# EAGLE design Helmet_Drop_V1 (EAGLE 9.6.2)
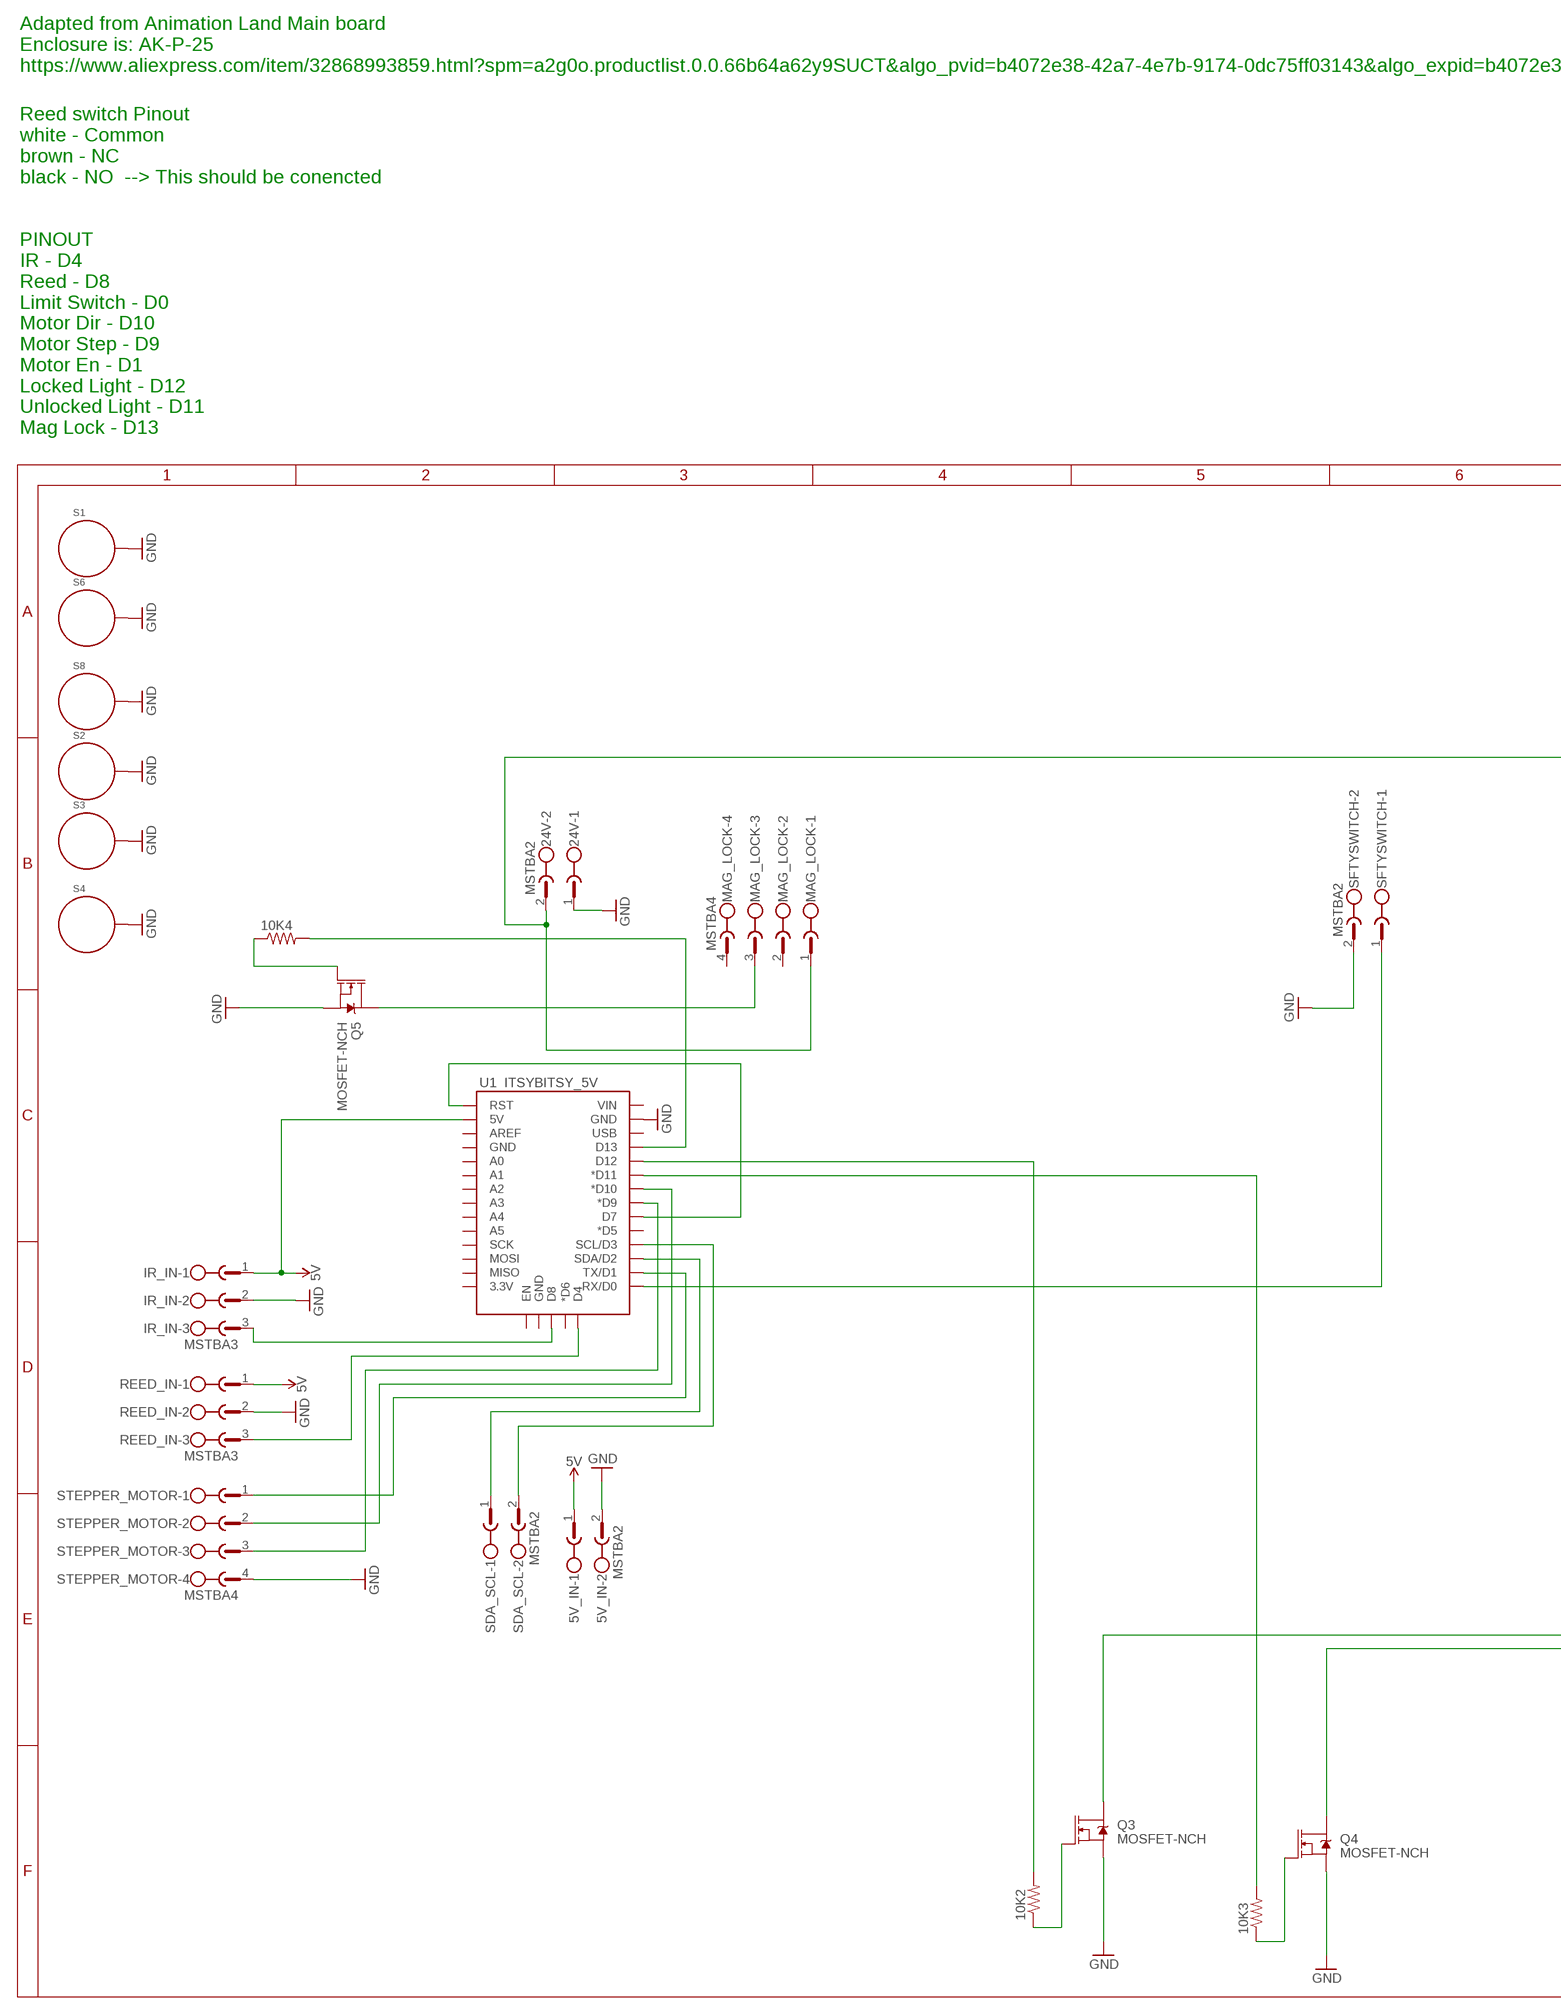
[diagram p0: schematic, sheet 1, part 1 of 2]
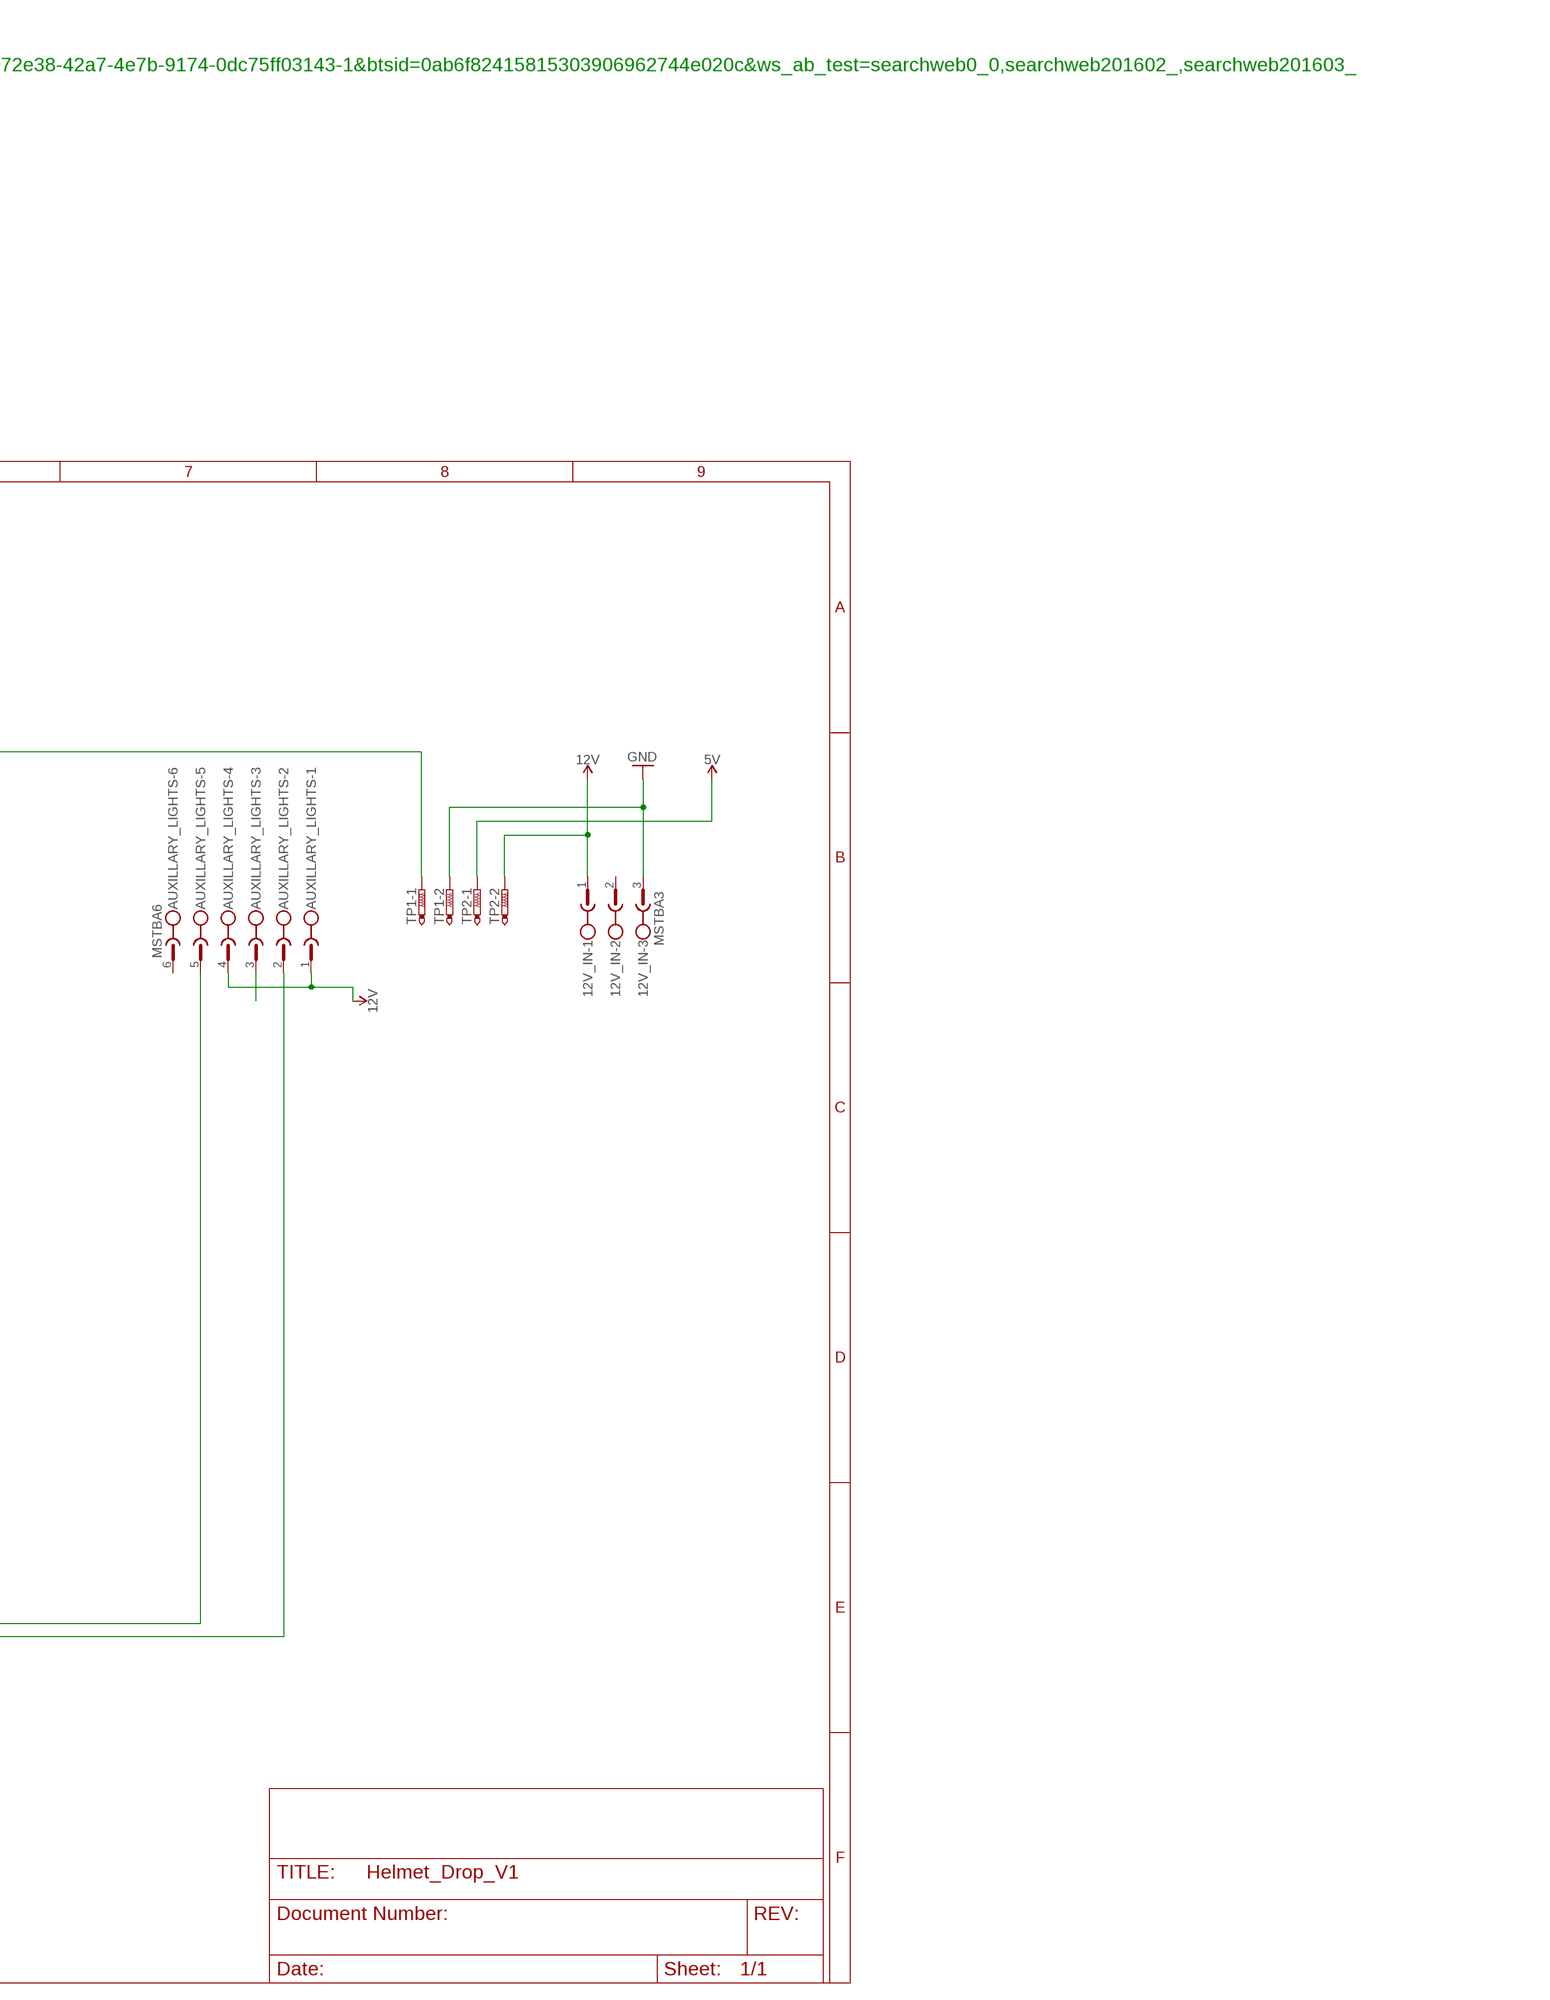
[diagram p1: schematic, sheet 1, part 2 of 2]

## Parts
5V_IN  MSTBA2  [MSTBA2]
10K2  R-US_M0805  [M0805]
10K3  R-US_M0805  [M0805]
10K4  R-US_M0805  [M0805]
12V_IN  MSTBA3  [MSTBA3]
24V  MSTBA2  [MSTBA2]
AUXILLARY_LIGHTS  MSTBA6  [MSTBA6]
IR_IN  MSTBA3  [MSTBA3]
MAG_LOCK  MSTBA4  [MSTBA4]
Q3  MOSFET-NCH  [SO-8_POWER_PAK]
Q4  MOSFET-NCH  [SO-8_POWER_PAK]
Q5  MOSFET-NCH  [SO-8_POWER_PAK]
REED_IN  MSTBA3  [MSTBA3]
S1  STANDOFF_ELECTRICAL5-32  [STANDOFF_ELECTRICAL_5_32]
S2  STANDOFF_ELECTRICAL5-32  [STANDOFF_ELECTRICAL_5_32]
S3  STANDOFF_ELECTRICAL5-32  [STANDOFF_ELECTRICAL_5_32]
S4  STANDOFF_ELECTRICAL5-32  [STANDOFF_ELECTRICAL_5_32]
S6  STANDOFF_ELECTRICAL5-32  [STANDOFF_ELECTRICAL_5_32]
S8  STANDOFF_ELECTRICAL5-32  [STANDOFF_ELECTRICAL_5_32]
SDA_SCL  MSTBA2  [MSTBA2]
SFTYSWITCH  MSTBA2  [MSTBA2]
STEPPER_MOTOR  MSTBA4  [MSTBA4]
TP1  PTR2  [P2-38-17]
TP2  PTR2  [P2-38-17]
U1  ITSYBITSY_5V  [ADAFRUIT_LENOARDO]

## Nets
5V: 5V_IN.1 IR_IN.1 REED_IN.1 TP2.TP-1 U1.5V
12V: 12V_IN.1 AUXILLARY_LIGHTS.1 AUXILLARY_LIGHTS.4 TP2.TP-2
GND: 5V_IN.2 12V_IN.3 24V.1 IR_IN.2 Q3.S Q4.S Q5.S REED_IN.2 S1.P1 S2.P1 S3.P1 S4.P1 S6.P1 S8.P1 SFTYSWITCH.2 STEPPER_MOTOR.4 TP1.TP-2 U1.GND@2(GND)
N$1: 10K4.2 U1.D13
N$2: SFTYSWITCH.1 U1.RX(RX/D0)
N$3: AUXILLARY_LIGHTS.3
N$4: STEPPER_MOTOR.3 U1.D9(*D9)
N$5: U1.D7 U1.RES(RST)
N$8: STEPPER_MOTOR.2 U1.D10(*D10)
N$10: AUXILLARY_LIGHTS.5 Q3.D1(D)
N$11: STEPPER_MOTOR.1 U1.TX(TX/D1)
N$12: 10K2.1 Q3.G
N$14: REED_IN.3 U1.D4
N$15: IR_IN.3 U1.D8
N$16: SDA_SCL.1 U1.SDA(SDA/D2)
N$17: SDA_SCL.2 U1.SCL(SCL/D3)
N$18: 10K2.2 U1.D12
N$21: MAG_LOCK.3 Q5.D1(D)
N$22: 24V.2 MAG_LOCK.1 TP1.TP-1
N$24: AUXILLARY_LIGHTS.2 Q4.D1(D)
N$25: 10K3.2 U1.D11(*D11)
N$27: 10K3.1 Q4.G
N$28: 10K4.1 Q5.G
Unconnected: 12V_IN.2 AUXILLARY_LIGHTS.6 MAG_LOCK.2 MAG_LOCK.4 U1.3V(3.3V) U1.A0 U1.A1 U1.A2 U1.A3 U1.A4 U1.A5 U1.AREF U1.D5(*D5) U1.D6(*D6) U1.EN U1.GND@0(GND) U1.GND@1(GND) U1.MISO U1.MOSI U1.SCK U1.USB U1.VIN

## Notes on the sheet
- Adapted from Animation Land Main board
  Enclosure is: AK-P-25
  https://www.aliexpress.com/item/32868993859.html?spm=a2g0o.productlist.0.0.66b64a62y9SUCT&algo_pvid=b4072e38-42a7-4e7b-9174-0dc75ff03143&algo_expid=b4072e38-42a7-4e7b-9174-0dc75ff03143-1&btsid=0ab6f82415815303906962744e020c&ws_ab_test=searchweb0_0,searchweb201602_,searchweb201603_
- Reed switch Pinout
  white - Common
  brown - NC
  black - NO  --> This should be conencted
  
  
  PINOUT
  IR - D4
  Reed - D8
  Limit Switch - D0
  Motor Dir - D10
  Motor Step - D9
  Motor En - D1
  Locked Light - D12
  Unlocked Light - D11
  Mag Lock - D13

## Library data of the parts
5V_IN 24V SDA_SCL SFTYSWITCH = th_libraries:MSTBA2: PHOENIX; MF: FARNELL; MPN: 1757242; OC_FARNELL: 3705171; OC_NEWARK: 71C4161
10K2-10K4 = adafruit:R-US_: RESISTOR, American symbol
12V_IN IR_IN REED_IN = con-phoenix-508:MSTBA3: PHOENIX; MF: FARNELL; MPN: 1757255; OC_FARNELL: 3705183; OC_NEWARK: 71C4162
AUXILLARY_LIGHTS = con-phoenix-508:MSTBA6: PHOENIX; MF: FARNELL; MPN: 1757284; OC_FARNELL: 3705213; OC_NEWARK: 71C4165
MAG_LOCK STEPPER_MOTOR = th_libraries:MSTBA4: PHOENIX; MF: FARNELL; MPN: 1757268; OC_FARNELL: 3705195; OC_NEWARK: 71C4163
Q3-Q5 = th_ds_libraries:MOSFET-NCH: N-channel MOSFETs from Sparkfun-DiscreteSemi Library
S1-S4 S6 S8 = th_libraries:STANDOFF_ELECTRICAL: A standoff intended to be an electrically connected point. Pad size and stop size allow for a #8 Phillips pan screw head to make a solid connection to the board. Added 144mill drill hole that fits my normal wood screw
TP1 TP2 = testpad:PTR2: TEST PIN
U1 = th_ds_libraries:ITSYBITSY_5V: Adafruit ItsyBitsy 32u4 - 5V 16MHz https://www.adafruit.com/product/3677

## Board
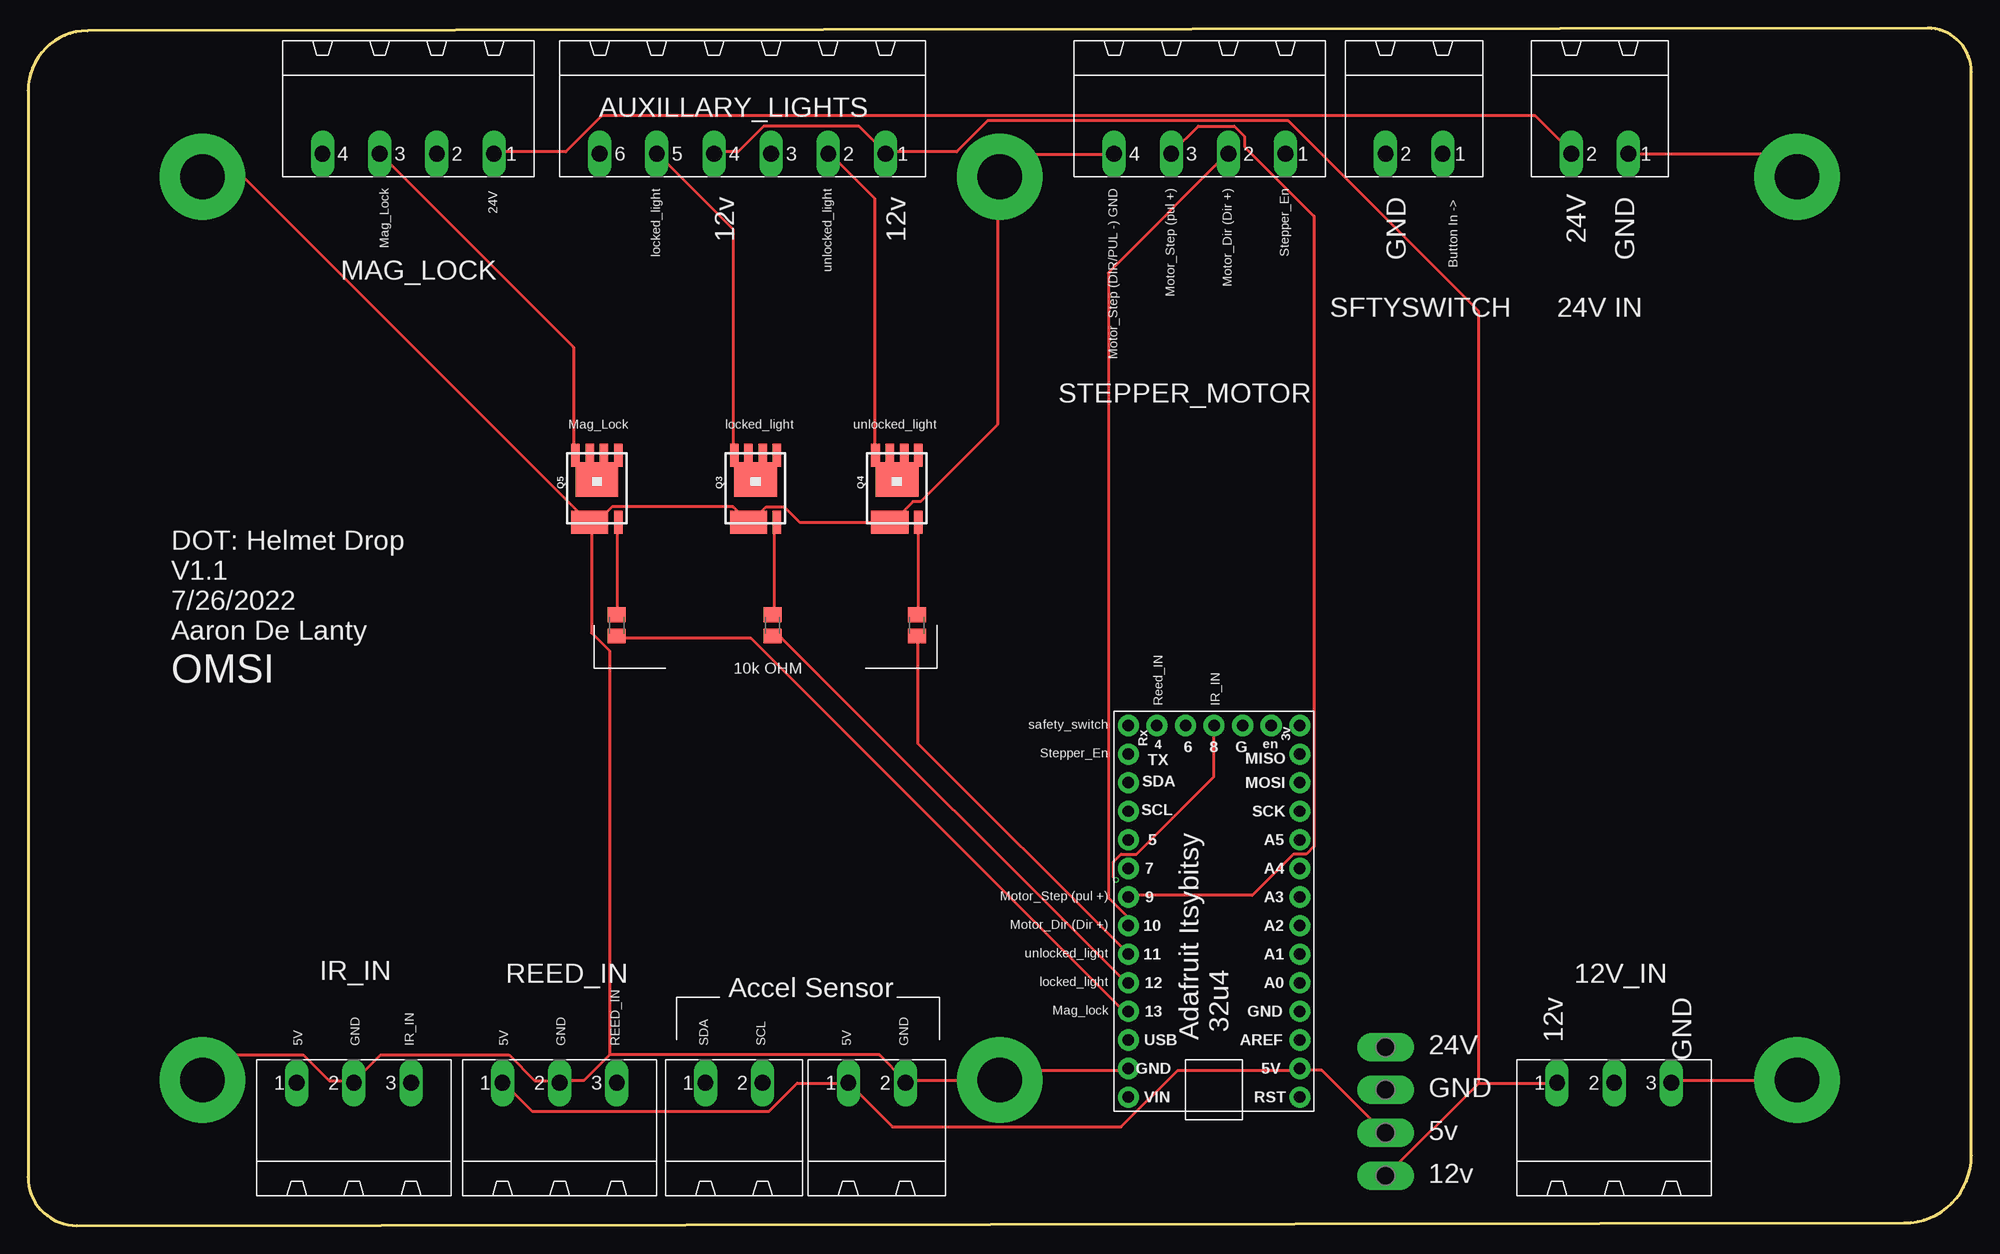
[diagram p2: board, top side]
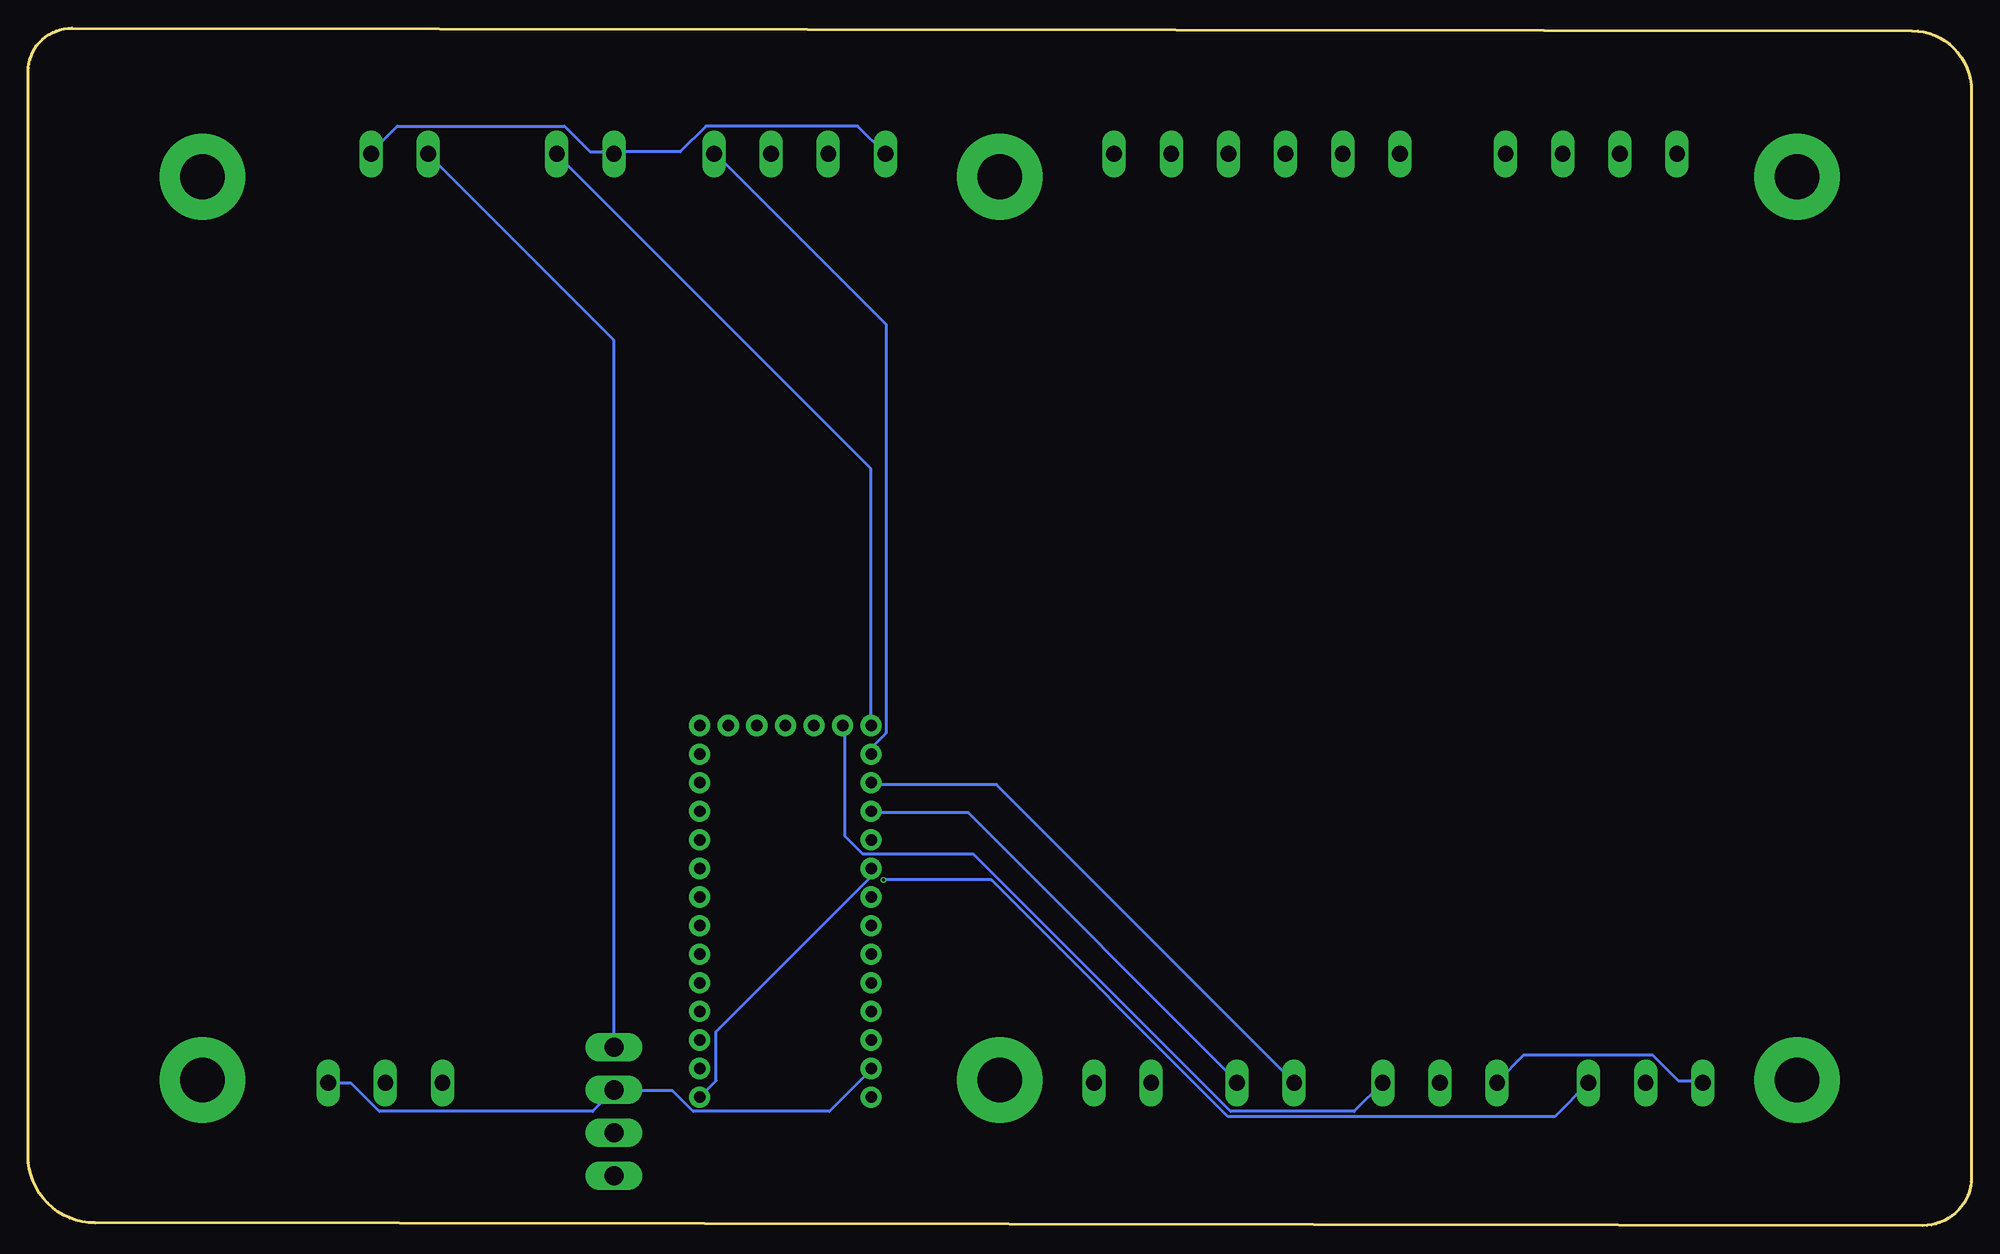
[diagram p3: board, bottom side, seen from below]

Size 172.72 x 106.41 mm. Coordinates in mm from the lower left corner, seen from the top.
Outline: 168.83,106.41 5.28,106.17 arc90 0,100.89 0,4.33 arc90 4.33,0 166.75,0.24 arc90 172.72,6.22 172.72,102.53 arc90 168.83,106.41
Copper layers (1*16): Top 0.035559375mm / dielectric 1.6mm / Bottom 0.035559375mm
Design rules "oshpark-2layer (1) *": minimum track width 10mil, minimum drill 10mil, track to track 8mil, track to pad 8mil, pad to pad 8mil, via to via 8mil, smd to smd 8mil, copper to edge 15mil, drill to drill 6mil, minimum pad ring 5mil, minimum via ring 5mil, stop-mask expansion 2.5mil, vias tented up to drill 25mil, thermal gap 10mil

### Footprints (pad centres in the part's own frame; a part is rotated, then mirrored left to right if it is on the bottom)
MSTBA2 = drill 1.397 long: 1 -2.54,5.08; 2 2.54,5.08
M0805 = smd 1.3 x 1.6: 1 -0.95,0; 2 0.95,0
MSTBA3 = drill 1.397 long: 1 -5.08,5.08; 2 0,5.08; 3 5.08,5.08
MSTBA6 = drill 1.397 long: 1 -12.7,5.08; 2 -7.62,5.08; 3 -2.54,5.08; 4 2.54,5.08; 5 7.62,5.08; 6 12.7,5.08
MSTBA4 = drill 1.397 long: 1 -7.62,5.08; 2 -2.54,5.08; 3 2.54,5.08; 4 7.62,5.08
SO-8_POWER_PAK = smd 0.762 x 2.032: D1 -3.423,2.437; D2 -2.153,2.437; D3 -0.883,2.437; D4 0.387,2.437; G 0.387,-3.532 | smd 3.81 x 3.048: D5 -1.518,0.278 | smd 3.302 x 2.032: S -2.153,-3.532
STANDOFF_ELECTRICAL_5_32 = drill 3.969 pad 7.62: P1 0,0
P2-38-17 = drill 1.702 pad 2.121 long: TP-1 -1.905,0; TP-2 1.905,0
ADAFRUIT_LENOARDO = drill 1.016 pad 1.88: 3V -10.16,-21.59; 5V -10.16,8.89; A0 -10.16,1.27; A1 -10.16,-1.27; A2 -10.16,-3.81; A3 -10.16,-6.35; A4 -10.16,-8.89; A5 -10.16,-11.43; AREF -10.16,6.35; D4 2.54,-21.59; D5 5.08,-11.43; D6 0,-21.59; D7 5.08,-8.89; D8 -2.54,-21.59; D9 5.08,-6.35; D10 5.08,-3.81; D11 5.08,-1.27; D12 5.08,1.27; D13 5.08,3.81; EN -7.62,-21.59; GND@0 -10.16,3.81; GND@1 -5.08,-21.59; GND@2 5.08,8.89; MISO -10.16,-19.05; MOSI -10.16,-16.51; RES -10.16,11.43; RX 5.08,-21.59; SCK -10.16,-13.97; SCL 5.08,-13.97; SDA 5.08,-16.51; TX 5.08,-19.05; USB 5.08,6.35; VIN 5.08,11.43

### Placement (x,y rotation side)
5V_IN  75.44,7.61 0 top
10K2  66.16,53.33 270 top
10K3  78.99,53.33 270 top
10K4  52.32,53.33 270 top
12V_IN  140.97,7.61 0 top
24V  139.7,100.32 180 top
AUXILLARY_LIGHTS  63.5,100.32 180 top
IR_IN  28.96,7.61 0 top
MAG_LOCK  33.78,100.32 180 top
Q3  66.17,66.03 0 top
Q4  78.74,66.03 0 top
Q5  52.07,66.03 0 top
REED_IN  47.24,7.61 0 top
S1  15.49,93.21 0 top
S2  86.36,93.21 0 top
S3  157.23,12.95 0 top
S4  157.23,93.21 0 top
S6  86.36,12.95 0 top
S8  15.49,12.95 0 top
SDA_SCL  62.74,7.61 0 top
SFTYSWITCH  123.19,100.32 180 top
STEPPER_MOTOR  104.14,100.32 180 top
TP1  120.65,13.96 270 top
TP2  120.65,6.34 270 top
U1  102.87,22.85 180 top

### Tracks (layer width: path | path; a pad name or v marks a point on that pad's centre or on a via)
5V
  Top 0.254: TP2.TP-1 120.47,8.32 114.99,13.81 113.16,13.81 U1.5V 112.93,13.81 102.18,13.81 97.16,8.78 76.81,8.78 5V_IN.1 72.69,12.67 68.35,12.67 65.84,10.15 44.81,10.15 42.29,12.67 REED_IN.1
  Bottom 0.254: IR_IN.1 24,12.9 26.06,12.9 28.35,15.18 39.78,15.18 42.06,12.9 REED_IN.1
12V
  Top 0.254: AUXILLARY_LIGHTS.4 61.04,95.42 63.09,95.42 65.38,97.71 73.84,97.71 76.12,95.42 AUXILLARY_LIGHTS.1 76.35,95.42 82.53,95.42 85.27,98.16 112.01,98.16 128.93,81.25 128.93,12.67 | 128.93,12.67 135.79,12.67 12V_IN.1 | 128.93,12.67 120.7,4.44 TP2.TP-2
GND
  Top 0.254: S8.P1 15.54,13.13 17.6,15.18 24.46,15.18 26.75,12.9 28.8,12.9 IR_IN.2 29.03,12.9 31.32,15.18 42.75,15.18 45.03,12.9 47.09,12.9 REED_IN.2 47.32,12.9 49.38,12.9 51.66,15.18 | 12V_IN.3 146.08,12.9 157.05,12.9 S3.P1 | U1.GND@2 97.61,13.81 87.1,13.81 86.41,13.13 S6.P1 86.18,12.9 78.18,12.9 5V_IN.2 77.95,12.9 75.67,15.18 51.66,15.18 | 24V.1 142.42,95.19 155.22,95.19 157.05,93.36 S4.P1 | Q5.S 50.06,62.5 50.52,62.5 51.89,63.87 62.64,63.87 64.01,62.5 Q3.S 64.24,62.5 65.61,63.87 67.21,63.87 68.58,62.5 Q4.S 76.81,62.5 78.64,64.33 79.32,64.33 86.18,71.19 86.18,93.14 S2.P1 86.41,93.36 88.24,95.19 96.47,95.19 STEPPER_MOTOR.4 | S1.P1 15.54,93.14 19.2,93.14 49.84,62.5 Q5.S | 51.66,15.18 51.66,51.07 50.06,52.67 50.06,62.27 Q5.S
  Bottom 0.254: U1.GND@2 97.84,13.81 101.5,10.15 113.61,10.15 115.44,11.98 120.47,11.98 TP1.TP-2 120.7,11.98 122.53,10.15 141.5,10.15 144.02,12.67 145.85,12.67 12V_IN.3 | 24V.1 142.19,95.42 139.9,97.71 125.04,97.71 122.76,95.42 120.7,95.42 SFTYSWITCH.2 120.47,95.42 114.76,95.42 112.47,97.71 98.98,97.71 STEPPER_MOTOR.4
N$1
  Top 0.254: 10K4.2 52.35,52.22 64.24,52.22 97.61,18.84 U1.D13
N$2
  Bottom 0.254: U1.RX 97.84,44.44 97.84,67.3 125.73,95.19 SFTYSWITCH.1
N$4
  Top 0.254: U1.D9 97.84,29.36 108.81,29.36 112.47,33.01 113.61,33.01 114.3,33.7 114.3,89.71 108.13,95.88 108.13,96.79 107.21,97.71 104.01,97.71 101.73,95.42 STEPPER_MOTOR.3
N$5
  Bottom 0.254: U1.RES 111.56,12.9 111.56,17.24 97.84,30.96 97.84,31.64 U1.D7
N$8
  Top 0.254: U1.D10 97.61,26.84 97.61,27.53 96.01,29.13 96.01,84.68 106.53,95.19 STEPPER_MOTOR.2
N$10
  Top 0.254: Q3.D1 62.64,68.68 62.64,88.56 56.01,95.19 AUXILLARY_LIGHTS.5
N$11
  Bottom 0.254: U1.TX 97.61,41.93 97.61,42.61 96.47,43.76 96.47,80.11 111.56,95.19 STEPPER_MOTOR.1
N$12
  Top 0.254: 10K2.1 66.29,54.5 66.29,62.05 66.52,62.27 Q3.G
N$14
  Bottom 0.254: REED_IN.3 54.86,10.15 65.84,10.15 88.7,33.01 98.53,33.01 100.13,34.61 100.13,44.44 U1.D4
N$15  (via drill 0.25)
  Top 0.254: v96.7,30.73 96.47,30.96 96.47,32.33 97.16,33.01 98.53,33.01 105.38,39.87 105.38,44.44 U1.D8
  Bottom 0.254: v96.7,30.73 87.1,30.73 66.06,9.7 37.03,9.7 IR_IN.3
N$16
  Bottom 0.254: U1.SDA 97.61,39.19 86.64,39.19 60.35,12.9 SDA_SCL.1
N$17
  Bottom 0.254: U1.SCL 97.61,36.67 89.15,36.67 65.38,12.9 SDA_SCL.2
N$18
  Top 0.254: 10K2.2 66.29,52.22 66.98,52.22 97.61,21.58 U1.D12
N$21
  Top 0.254: Q5.D1 48.46,68.68 48.46,78.05 31.32,95.19 MAG_LOCK.3
N$22
  Top 0.254: MAG_LOCK.1 41.61,95.42 47.78,95.42 50.98,98.62 133.96,98.62 137.16,95.42 24V.2
  Bottom 0.254: TP1.TP-1 120.7,15.87 120.7,78.73 137.16,95.19 24V.2
N$24
  Top 0.254: Q4.D1 75.21,68.68 75.21,91.31 71.32,95.19 AUXILLARY_LIGHTS.2
N$25
  Top 0.254: 10K3.2 79.1,52.22 79.1,42.84 97.61,24.33 U1.D11
N$27
  Top 0.254: 10K3.1 79.1,54.5 79.1,62.27 Q4.G
N$28
  Top 0.254: 10K4.1 52.35,54.5 52.35,62.27 Q5.G

### Text on the board
tPlace: Adafruit Itsybitsy / 32u4
tNames: Mag_Lock | 24V | locked_light | 12v | unlocked_light | 12v | Motor_Step (DIR/PUL -) GND | Motor_Step (pul +) | Motor_Dir (Dir +) | Stepper_En | GND | 24V | GND | Button In -> | 24V IN | Mag_Lock | locked_light | unlocked_light | DOT: Helmet Drop / V1.1 / 7/26/2022 / Aaron De Lanty | 10k OHM | OMSI | Reed_IN | IR_IN | safety_switch | Stepper_En | Motor_Step (pul +) | Motor_Dir (Dir +) | unlocked_light | locked_light | Accel Sensor | 12v | GND | Mag_lock | 5V | GND | IR_IN | 5V | GND | REED_IN | SDA | SCL | 5V | GND | 24V | GND | 5v | 12v